# Altium schematic sheet 03-ETHERNET.SchDoc
size C
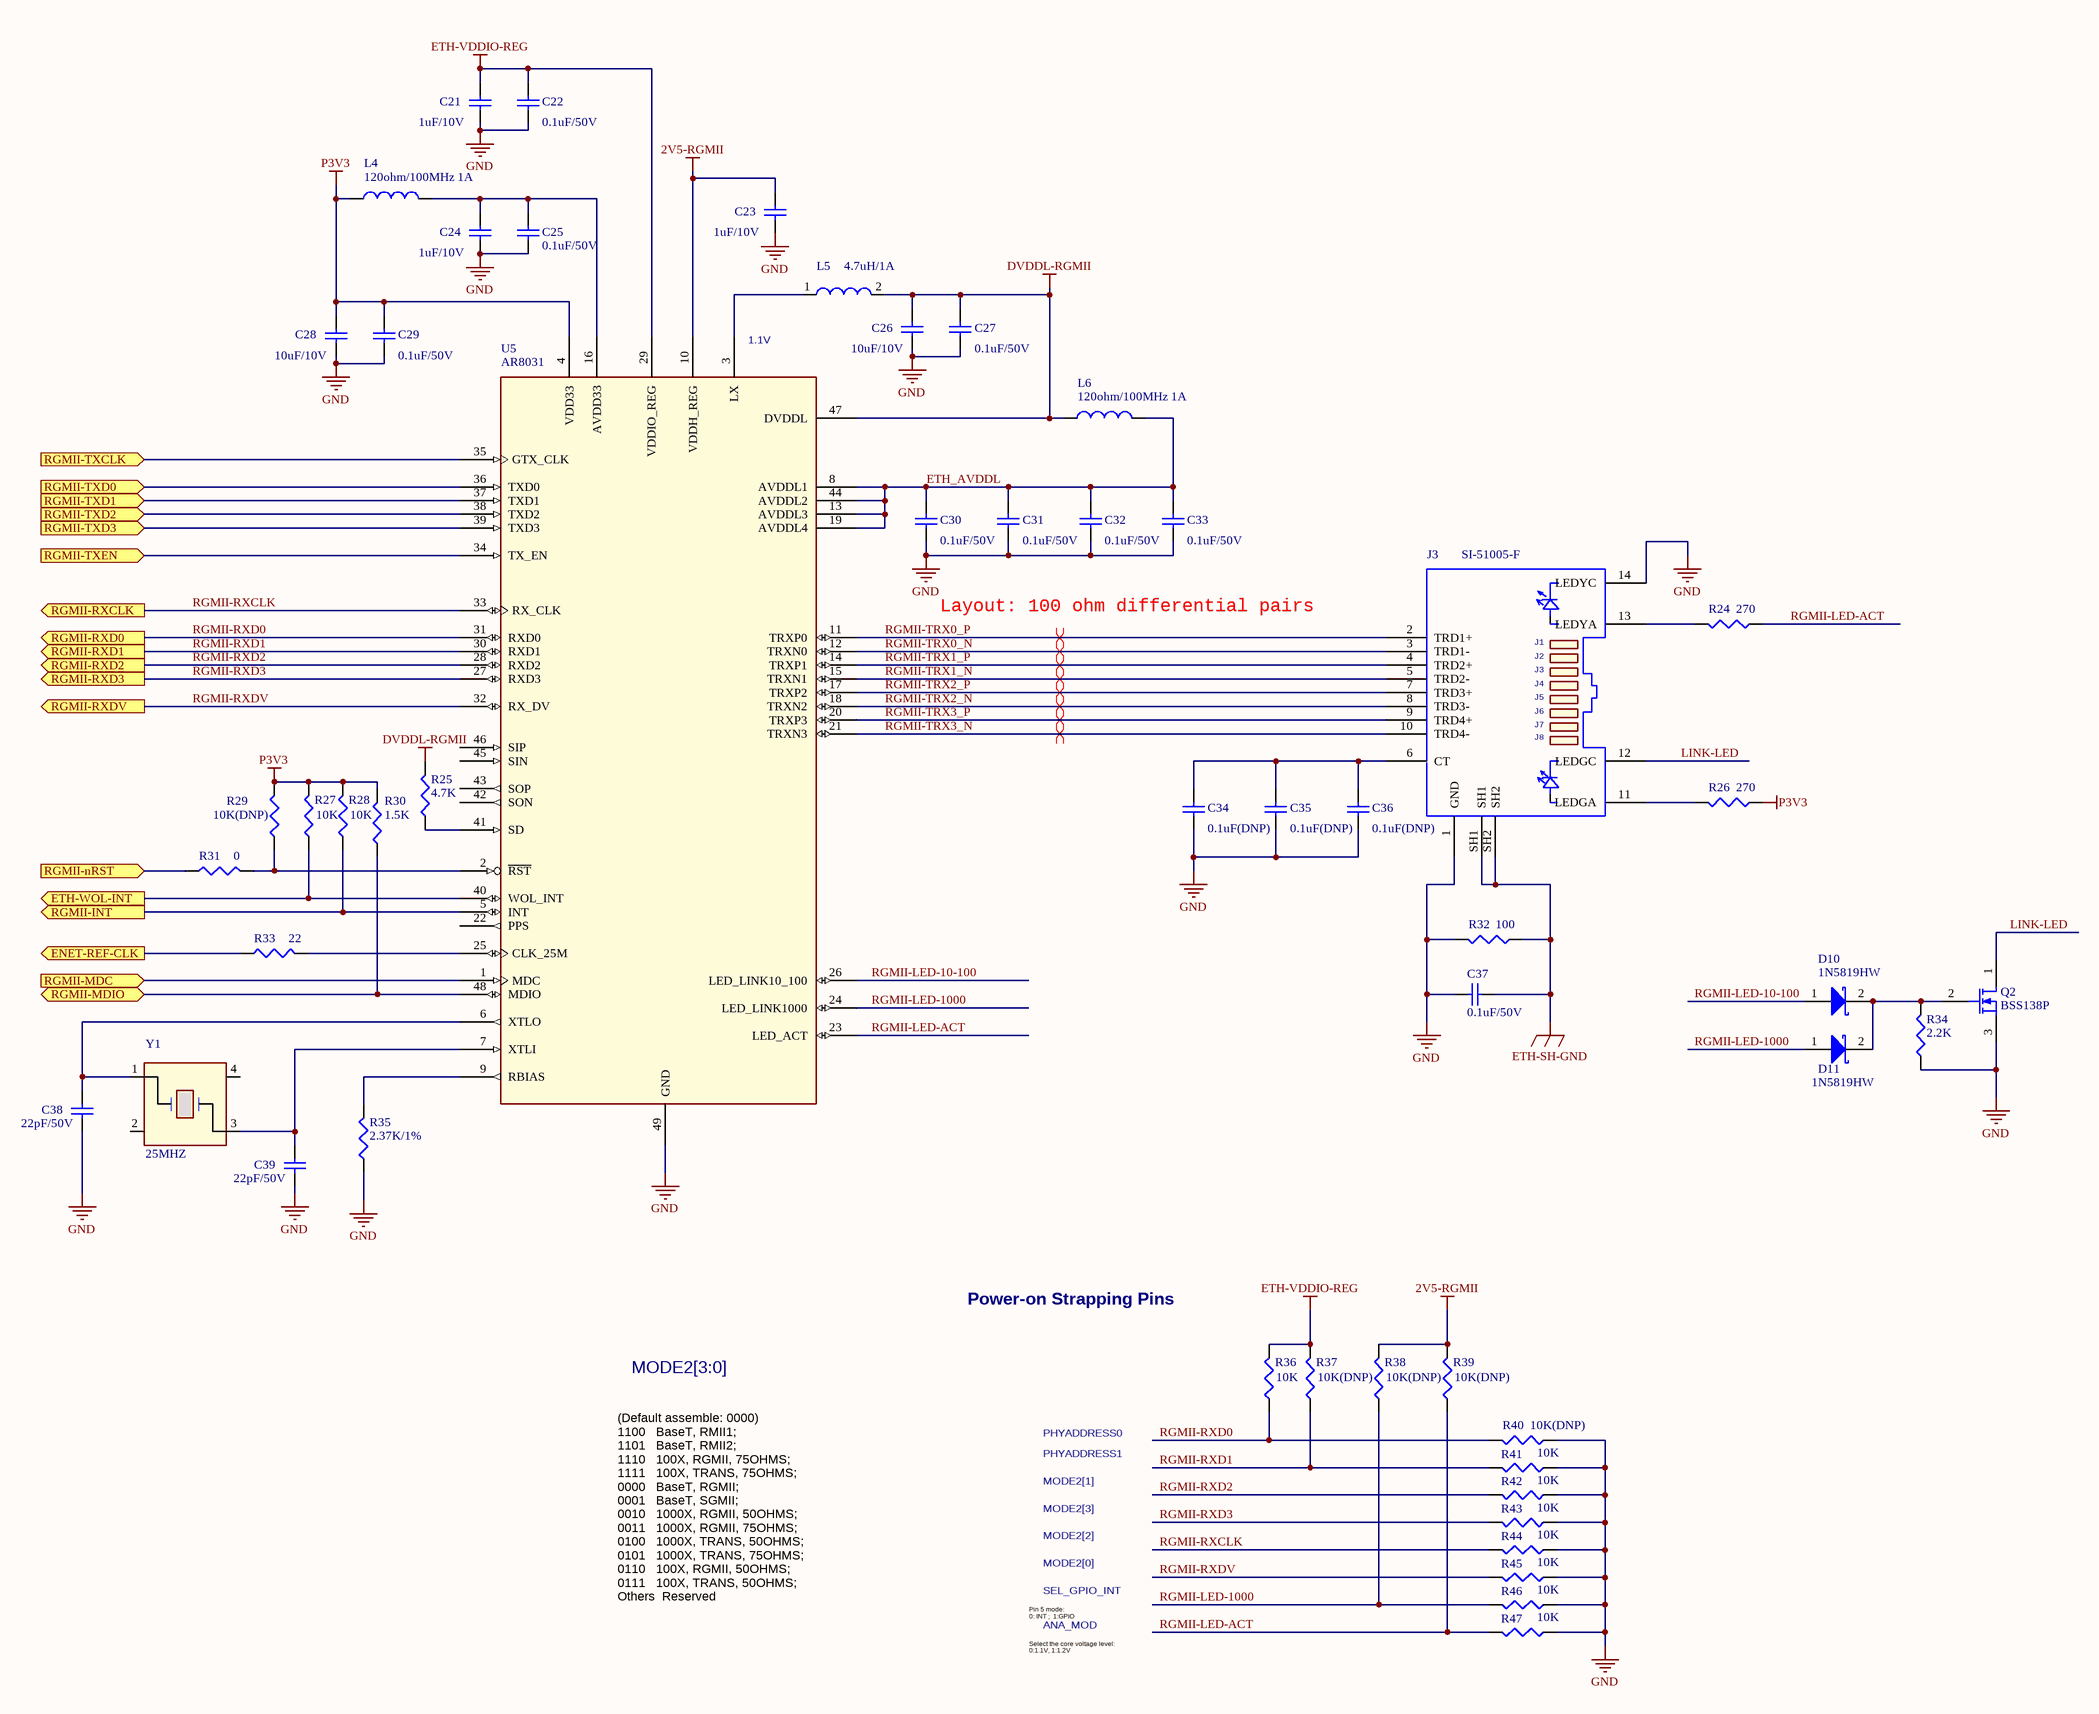
[diagram p0: 03-ETHERNET.SchDoc]

## Parts
C21  1uF/10V  [0402]
C22  0.1uF/50V  [0402]
C23  1uF/10V  [0402]
C24  1uF/10V  [0402]
C25  0.1uF/50V  [0402]
C26  10uF/10V  [0805]
C27  0.1uF/50V  [0402]
C28  10uF/10V  [0805]
C29  0.1uF/50V  [0402]
C30  0.1uF/50V  [0402]
C31  0.1uF/50V  [0402]
C32  0.1uF/50V  [0402]
C33  0.1uF/50V  [0402]
C34  0.1uF(DNP)  [0603]
C35  0.1uF(DNP)  [0603]
C36  0.1uF(DNP)  [0603]
C37  0.1uF/50V  [0402]
C38  22pF/50V  [0402]
C39  22pF/50V  [0402]
D10  1N5819HW  [1N5819]
D11  1N5819HW  [1N5819]
J3  SI-51005-F  [SI-51005-F]
L4  120ohm/100MHz 1A  [0603]
L5  4.7uH/1A  [IND-4.7UH-1A]
L6  120ohm/100MHz 1A  [0603]
Q2  BSS138P  [NPN]
R24  270  [0402]
R25  4.7K  [0402]
R26  270  [0402]
R27  10K  [0402]
R28  10K  [0402]
R29  10K(DNP)  [0402]
R30  1.5K  [0402]
R31  0  [0402]
R32  100  [0402]
R33  22  [0402]
R34  2.2K  [0402]
R35  2.37K/1%  [0402]
R36  10K  [0402]
R37  10K(DNP)  [0402]
R38  10K(DNP)  [0402]
R39  10K(DNP)  [0402]
R40  10K(DNP)  [0402]
R41  10K  [0402]
R42  10K  [0402]
R43  10K  [0402]
R44  10K  [0402]
R45  10K  [0402]
R46  10K  [0402]
R47  10K  [0402]
U5  AR8031  [QFN48]
Y1  25MHZ  [XTAL4_SX_3225]

## Ports
ENET-REF-CLK (out), ETH-WOL-INT (out), RGMII-INT (out), RGMII-MDC (in), RGMII-MDIO (bidir), RGMII-nRST (in), RGMII-RXCLK (out), RGMII-RXD0 (out), RGMII-RXD1 (out), RGMII-RXD2 (out), RGMII-RXD3 (out), RGMII-RXDV (out), RGMII-TXCLK (in), RGMII-TXD0 (in), RGMII-TXD1 (in), RGMII-TXD2 (in), RGMII-TXD3 (in), RGMII-TXEN (in)

## Nets
2V5-RGMII: C23.1 R38.2 R39.2 U5.10(VDDH_REG)
DVDDL-RGMII: C26.1 C27.1 L5.2 L6.1 R25.2 U5.47(DVDDL)
ETH-SH-GND: C37.2 J3.SH1 J3.SH2 R32.1
ETH-VDDIO-REG: C21.1 C22.1 R36.2 R37.2 U5.29(VDDIO_REG)
GND: C21.2 C22.2 C23.2 C24.2 C25.2 C26.2 C27.2 C28.2 C29.2 C30.2 C31.2 C32.2 C33.2 C34.2 C35.2 C36.2 C37.1 C38.2 C39.2 J3.1(GND) J3.14(LEDYC) Q2.3(S) R32.2 R34.1 R35.1 R40.1 R41.1 R42.1 R43.1 R44.1 R45.1 R46.1 R47.1 U5.49(GND)
P3V3: C28.1 C29.1 L4.1 R26.1 R27.2 R28.2 R29.2 R30.2 U5.4(VDD33)
ENET-REF-CLK: R33.1 ; port ENET-REF-CLK
ETH-WOL-INT: R27.1 U5.40(WOL_INT) ; port ETH-WOL-INT
ETH_AVDDL: C30.1 C31.1 C32.1 C33.1 L6.2 U5.8(AVDDL1) U5.13(AVDDL3) U5.19(AVDDL4) U5.44(AVDDL2)
LINK-LED: J3.12(LEDGC) Q2.1(D)
RGMII-INT: R28.1 U5.5(INT) ; port RGMII-INT
RGMII-LED-10-100: D10.1(A) U5.26(LED_LINK10_100)
RGMII-LED-1000: D11.1(A) R38.1 R46.2 U5.24(LED_LINK1000)
RGMII-LED-ACT: R24.1 R39.1 R47.2 U5.23(LED_ACT)
RGMII-MDC: U5.1(MDC) ; port RGMII-MDC
RGMII-MDIO: R30.1 U5.48(MDIO) ; port RGMII-MDIO
RGMII-nRST: R31.1 ; port RGMII-nRST
RGMII-RXCLK: R44.2 U5.33(RX_CLK) ; port RGMII-RXCLK
RGMII-RXD0: R36.1 R40.2 U5.31(RXD0) ; port RGMII-RXD0
RGMII-RXD1: R37.1 R41.2 U5.30(RXD1) ; port RGMII-RXD1
RGMII-RXD2: R42.2 U5.28(RXD2) ; port RGMII-RXD2
RGMII-RXD3: R43.2 U5.27(RXD3) ; port RGMII-RXD3
RGMII-RXDV: R45.2 U5.32(RX_DV) ; port RGMII-RXDV
RGMII-TRX0_N: J3.3(TRD1-) U5.12(TRXN0)
RGMII-TRX0_P: J3.2(TRD1+) U5.11(TRXP0)
RGMII-TRX1_N: J3.5(TRD2-) U5.15(TRXN1)
RGMII-TRX1_P: J3.4(TRD2+) U5.14(TRXP1)
RGMII-TRX2_N: J3.8(TRD3-) U5.18(TRXN2)
RGMII-TRX2_P: J3.7(TRD3+) U5.17(TRXP2)
RGMII-TRX3_N: J3.10(TRD4-) U5.21(TRXN3)
RGMII-TRX3_P: J3.9(TRD4+) U5.20(TRXP3)
RGMII-TXCLK: U5.35(GTX_CLK) ; port RGMII-TXCLK
RGMII-TXD0: U5.36(TXD0) ; port RGMII-TXD0
RGMII-TXD1: U5.37(TXD1) ; port RGMII-TXD1
RGMII-TXD2: U5.38(TXD2) ; port RGMII-TXD2
RGMII-TXD3: U5.39(TXD3) ; port RGMII-TXD3
RGMII-TXEN: U5.34(TX_EN) ; port RGMII-TXEN
NetC24_1: C24.1 C25.1 L4.2 U5.16(AVDD33)
NetC34_1: C34.1 C35.1 C36.1 J3.6(CT)
NetC38_1: C38.1 U5.6(XTLO) Y1.1
NetC39_1: C39.1 U5.7(XTLI) Y1.3
NetD10_2: D10.2(K) D11.2(K) Q2.2(G) R34.2
NetJ3_11: J3.11(LEDGA) R26.2
NetJ3_13: J3.13(LEDYA) R24.2
NetL5_1: L5.1 U5.3(LX)
NetR25_1: R25.1 U5.41(SD)
NetR29_1: R29.1 R31.2 U5.2(~{RST})
NetR33_2: R33.2 U5.25(CLK_25M)
NetR35_2: R35.2 U5.9(RBIAS)

Not connected (* = marked no-connect by the designer): U5 22(PPS) 42(SON) 43(SOP) 45(SIN) 46(SIP); Y1 2 4

## Layout directives
differential pair: RGMII-TRX0_N, RGMII-TRX0_P, RGMII-TRX1_N, RGMII-TRX1_P, RGMII-TRX2_N, RGMII-TRX2_P, RGMII-TRX3_N, RGMII-TRX3_P

## Notes on the sheet
- (near U5) 1.1V
- Layout: 100 ohm differential pairs
- Power-on Strapping Pins
- MODE2[3:0]
- PHYADDRESS0
- PHYADDRESS1
- MODE2[2]
- MODE2[3]
- MODE2[1]
- SEL_GPIO_INT
- MODE2[0]
- (Default assemble: 0000)
  1100   BaseT, RMII1;
  1101   BaseT, RMII2;
  1110   100X, RGMII, 75OHMS;
  1111   100X, TRANS, 75OHMS;
  0000   BaseT, RGMII;
  0001   BaseT, SGMII;
  0010   1000X, RGMII, 50OHMS;
  0011   1000X, RGMII, 75OHMS;
  0100   1000X, TRANS, 50OHMS;
  0101   1000X, TRANS, 75OHMS;
  0110   100X, RGMII, 50OHMS;
  0111   100X, TRANS, 50OHMS;
  Others  Reserved
- Pin 5 mode:
  0: INT ;  1:GPIO
- Select the core voltage level:
  0:1.1V, 1:1.2V
- ANA_MOD
- (in symbol SI-51005-F) J1; J2; J4; J5; J6; J7; J8

## Library data of the parts
C21-C39 = Cap: Capacitor; Published: 8-Jun-2000; LatestRevisionDate: 17-Jul-2002; LatestRevisionNote: Re-released for DXP Platform.; PackageReference: RAD-0.3; Publisher: Altium Limited; PackageDescription: Radial Cap, Thru-Hole; 2 Leads; 0.3 in Pin Spacing
D10 D11 = Diode 11DQ03: Schottky Rectifier
L4 L6 = Inductor: Code_IEC: 1005; Value: 300ohm/100MHz BEAD; Published: 8-Jun-2000; LatestRevisionDate: 29-May-2009; LatestRevisionNote: IPC-7351 Footprint Added.; PackageReference: 0402-A; Publisher: Altium Limited; PackageDescription: Chip Inductor; Code_JEITA: 0402
L5 = INDUCTOR: IND PWR 4.7UH@1MHZ 1A 20% SMD; PART_TYPE: INDUCTOR\POWER; CLASS: DISCRETE; SIGNAL_MODEL: DEFAULT_INDUCTOR_4700nH_2_1; PRIORITY_PN: 024-00152; CAD_APPROVED: Yes; MFG_PN01: VLS3012T-4R7M1R0; MFG_NAME01: TDK; AGILE_PN: 180-77706; ROOM: RGMII_PHY; HEIGHT: 1.2MM; ROHS: Yes; Tolerance: 20%
Q2 = MOSFET-N: N-Channel MOSFET; Published: 8-Jun-2000; LatestRevisionDate: 17-Jul-2002; LatestRevisionNote: Re-released for DXP Platform.; PackageVersion: 1995/1996; PackageReference: E3; Publisher: Altium Limited; PackageDescription: TO, Flat Index; 3 In-Line, Axial Leads; Body Dia. 4.6mm; Lead Dia. 0.5 mm (max)
R24-R47 = CR16-1003FM
U5 = AR8031_QFN48: IC XCVR ETHERNET PHY 10/100/1000G-BIT 3.3V QFN48; AGILE_PN: 312-80115; MFG_NAME01: QUALCOMM ATHEROS, INC; MFG_PN01: AR8031-AL1A; CAD_APPROVED: Yes; CLASS: IC; ROHS: Yes; HEIGHT: 0.8MM
Y1 = XTAL_13Y: XTAL 25MHZ -- -- SMT; CLASS: IC; AGILE_PN: 230-77853; MFG_NAME01: ABRACON CORP; MFG_PN01: ABMM-25.000MHZ-B2-T; CAD_APPROVED: Yes; ROHS: Yes; HEIGHT: 1.3MM